# Altium schematic sheet STB_USB.SchDoc: STB Control Board - USB
size A4; Author: mayerph; DrawnBy: mayerph; Organization: PBL; Revision: B; SheetNumber: 6; SheetTotal: 6
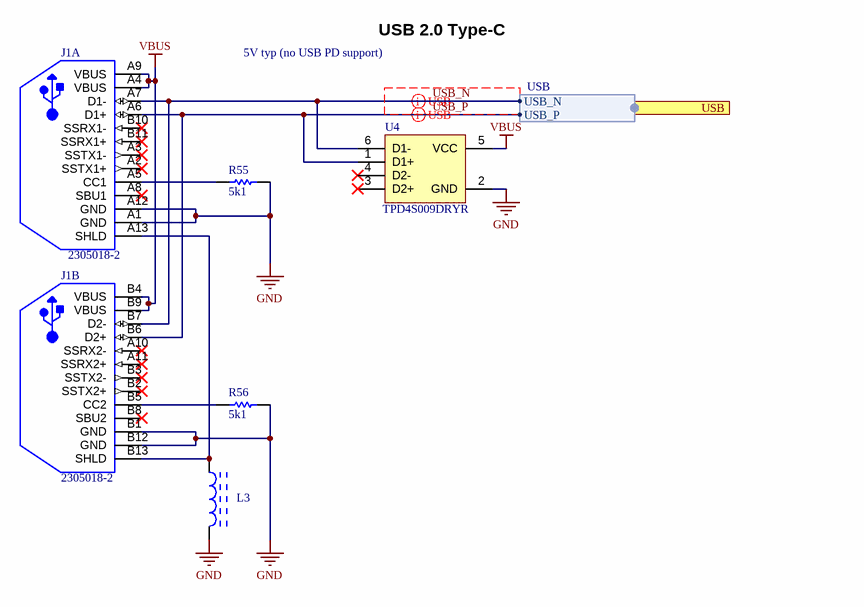
[diagram p0: STB_USB.SchDoc]

## Parts
J1  2305018-2  [2305018-2]  (parts A,B of 2)
L3  LI0402E300R-10  [INDC1005X07L]  (value not drawn)
R55  5k1  [RESC1005X40X25LL05T10]
R56  5k1  [RESC1005X40X25LL05T10]
U4  TPD4S009DRYR  [DRY0006A]

## Ports
USB (harness USB, see STB_ControlBoard[2A], STB_MCU[1A])

## Harnesses
USB: USB_N, USB_P

## Nets
GND: J1.A1(GND) J1.A12(GND) J1.B1(GND) J1.B12(GND) L3.2 R55.1 R56.1 U4.2(GND)
VBUS: J1.A4(VBUS) J1.A9(VBUS) J1.B4(VBUS) J1.B9(VBUS) U4.5(VCC)
USB_N: J1.A7(D1-) J1.B7(D2-) U4.6(D1-) ; port USB.USB_N
USB_P: J1.A6(D1+) J1.B6(D2+) U4.1(D1+) ; port USB.USB_P
NetJ1_A5: J1.A5(CC1) R55.2
NetJ1_A13: J1.A13(SHLD) J1.B13(SHLD) L3.1
NetJ1_B5: J1.B5(CC2) R56.2

Not connected (* = marked no-connect by the designer): J1 A2(SSTX1+)* A3(SSTX1-)* A8(SBU1)* A10(SSRX2-)* A11(SSRX2+)* B2(SSTX2+)* B3(SSTX2-)* B8(SBU2)* B10(SSRX1-)* B11(SSRX1+)*; U4 3(D2+)* 4(D2-)*

## Layout directives
differential pair; differential pair class USB_90R: USB_N, USB_P

## Notes on the sheet
- 5V typ (no USB PD support)
- USB 2.0 Type-C
- 1
- 2
- 3
- 4
- A
- B
- C
- Project:
- D
- Date:
- Drawing number:
- Rev:
- Format:
- A4 Q
- Drawn by:
- Laboratory:
- Page
- Sheet:
- of
- File:

## Library data of the parts
J1 = CMP-00966-1: USB TYPE C, REC IPX8 ON BOARD DUAL SMT; Manufacturer: TE Connectivity; Gender: Female; Number of Contacts: 24; Number of Ports: 1; Mounting Angle: Right Angle; IP Rating: IP67; Standard: USB; Termination Style: SMD/SMT; Mounting Style: Panel; Contact Plating: Gold; Type: C; Contact Material: Copper Alloy; Flammability Rating: UL 94 V-0; Shell Plating: Nickel; Manufacturer Part Number: 2305018-2; PartId: 1
L3 = CMP-00193-1: 30 Ohm 1 Power, Signal Line Ferrite Bead 0402 (1005 Metric) 500mA 300 mOhm Max DCR; Manufacturer: Laird-Signal Integrity Products; Number of Lines: 1; Impedance @ Frequency: 30 Ohm @ 100MHz; Packaging: Cut Tape (CT); Part Status: Active; Filter Type: Power, Signal Line; Current Rating (Max): 500mA; DC Resistance (DCR) (Max): 300 mOhm; Ratings: -; Operating Temperature: -40°C ~ 125°C; Package / Case: 0402 (1005 Metric); Mounting Type: Surface Mount; Manufacturer Part Number: LI0402E300R-10; Supplier: Digi-Key; Supplier Part Number: 240-2362-1-ND; ComponentLink1Description: Catalog_EMI%20Filtering%20&%20RF%20Inductors.pdf; ComponentLink1URL: http://cdn.lairdtech.com/home/brandworld/files/Catalog_EMI%20Filtering%20&%20RF%20Inductors.pdf
R55 R56 = CMP-2002-07753-1: Part Number: RC0402FR-075K1L; Manufacturer: Yageo / Phycomp; Tolerance: 1%; Rated Power Dissipation (P): 62.5mW; Value: 5.1 kOhm; Temperature Coefficient: 100ppm/°C; Working Voltage: 50V; Rated Temperature: 70°C; Additional Feature: LASER TRIMMABLE; Package Height: 0.35mm; Package Length: 1mm; Package Width: 0.5mm; Supplier 1: Digi-Key; Supplier Part Number 1: 311-5.10KLRDKR-ND; Manufacturer Part Number: RC0402FR-075K1L; RoHS: Yes; Category: Chip SMD Resistors; Stock 1: 2765402; Pricing 1: 1=0.10000, 10=0.01500, 100=0.00600, 1000=0.00267, 2500=0.00232, 5000=0.00192 (USD); Mount: Surface Mount; Number of Pins: 2; Package Shape: Rectangular; Size Code: 0402; Terminal Finish: Nickel; Min Operating Temperature: -55°C; Max Operating Temperature: 155°C; Resistor Type: FIXED RESISTOR; Technology: METAL GLAZE/THICK FILM; Termination: Wraparound; Packaging: Tape and Reel; Construction: Chip; Package Style: SMTMeter; JESD-609 Code: e3; REACH SVHC: Yes; RoHS Compliant: Yes; ComponentLink1URL: https://datasheet.ciiva.com:443/pdfs/VipMasterIC/IC/YAGO/YAGO-S-A0008145938/YAGO-S-A0008145938-1.pdf?src-supplier=IHS+Markit; ComponentLink1Description: https://datasheet.ciiva.com:443/pdfs/VipMasterIC/IC/YAGO/YAGO-S-A0008145938/YAGO-S-A0008145938-1.pdf?src-supplier=IHS+Markit; ComponentLink2URL: https://datasheet.ciiva.com/7983/1018594-7983519.pdf?src-supplier=Element14; ComponentLink2Description: https://datasheet.ciiva.com/7983/1018594-7983519.pdf?src-supplier=Element14; ComponentLink3URL: https://datasheet.ciiva.com/46394/1018594-46394936.pdf?src-supplier=Element14; ComponentLink3Description: https://datasheet.ciiva.com/46394/1018594-46394936.pdf?src-supplier=Element14; ComponentLink4URL: https://datasheet.ciiva.com/2453/pyu-r-int-thick-7-2453401.pdf?src-supplier=Digi-Key; ComponentLink4Description: https://datasheet.ciiva.com/2453/pyu-r-int-thick-7-2453401.pdf?src-supplier=Digi-Key; ComponentLink5URL: https://datasheet.ciiva.com/2453/pyu-r-int-thick-7-2453402.pdf?src-supplier=Digi-Key; ComponentLink5Description: https://datasheet.ciiva.com/2453/pyu-r-int-thick-7-2453402.pdf?src-supplier=Digi-Key; ComponentLink6URL: https://datasheet.ciiva.com/2453/pyu-r-int-thick-7-2453400.pdf?src-supplier=Digi-Key; ComponentLink6Description: https://datasheet.ciiva.com/2453/pyu-r-int-thick-7-2453400.pdf?src-supplier=Digi-Key; ComponentLink7URL: https://datasheet.ciiva.com/12558/pyu-rc0402-51-rohs-l-6-r-8721-12558460.pdf?src-supplier=Mouser; ComponentLink7Description: https://datasheet.ciiva.com/12558/pyu-rc0402-51-rohs-l-6-r-8721-12558460.pdf?src-supplier=Mouser; ComponentLink8URL: https://datasheet.ciiva.com/16744/pyu-rc0402-51-rohs-l-6-r-16744283.pdf?src-supplier=Future+Electronics; ComponentLink8Description: https://datasheet.ciiva.com/16744/pyu-rc0402-51-rohs-l-6-r-16744283.pdf?src-supplier=Future+Electronics; ComponentLink9URL: https://datasheet.ciiva.com/15189/getdatasheetpartid-323636-15189493.pdf?src-supplier=Verical; ComponentLink9Description: https://datasheet.ciiva.com/15189/getdatasheetpartid-323636-15189493.pdf?src-supplier=Verical
U4 = CMP-0326-00033-3: ESD Solution for High-Speed Differential Interface, 4 Channels, -40 to +85 degC, 6-pin SON (DRY), Green (RoHS & no Sb/Br); Manufacturer: Texas Instruments; Breakdown Voltage(Min)(V): 9; Differential Capacitance(pF): 0.05; IO Leakage Current(nA): Jan-00; IEC 61000-4-2 Contact(+/- kV): 8; IO Capacitance(Typ)(pF): 0.8; Direction: Unidirectional; Capacitance: 0.8pF; Number of Bidirectional Channels: 4; Reverse Standoff Voltage: 5.5V; Min Breakdown Voltage: 9V; Peak Pulse Power: 25W; Power Line Protection: Yes; Interface: LVDS,USB,Ethernet,HDMI,PCIe,SATA; Mounting Technology: Surface Mount; ComponentLink3URL: SamplesURL:http://www.ti.com/product/tpd4s009#samples; ComponentLink2URL: http://www.ti.com/general/docs/lit/getliterature.tsp?genericPartNumber=TPD4S009&fileType=pdf; ComponentLink1Description: Manufacturer URL; PackageDescription: 6-Pin Plastic Small Outline No-Lead, 1 x 1.45 x 0.6 mm Body, 0.5 mm Pitch; IEC 61000-4-2 Air-Gap(+/- kV): 9; Eco-Plan: Green (RoHS & no Sb/Br); PartNumber: TPD4S009DRYR; PackageReference: DRY0006A; DatasheetVersion: SLVS817E; ComponentLink3Description: URL Link1; SubFamily: ESD Solution; ComponentLink1URL: http://www.ti.com/; PackageVersion: revF, Dec-2011; ComponentLink2Description: Datasheet; Supplier 1: Digi-Key; Supplier Part Number 1: 296-23628-1-ND; Manufacturer Part Number: TPD4S009DRYR; RoHS: Yes; Category: Integrated Circuits (ICs); Stock 1: 8281; Pricing 1: 1=0.98000, 10=0.86400, 100=0.66240, 500=0.52364, 1000=0.41891, 2000=0.41249 (USD); Case/Package: SON; Number of Pins: 6; Contact Plating: Gold; Min Operating Temperature: -40°C; Max Operating Temperature: 85°C; Packaging: Tape and Reel; Package Quantity: 1; Breakdown Voltage: 9V; Working Voltage: 5.5V; Number of Unidirectional Channels: 4; Series: -; Length: 1.5mm; Depth: 1mm; Radiation Hardening: No; Lead Free: Lead Free; RoHS Compliant: Yes; ComponentLink4URL: https://datasheet.ciiva.com/15103/getdatasheetpartid-48198-15103810.pdf?src-supplier=Verical; ComponentLink4Description: https://datasheet.ciiva.com/15103/getdatasheetpartid-48198-15103810.pdf?src-supplier=Verical; ComponentLink5URL: https://datasheet.ciiva.com/339/tpd4s009-339414.pdf?src-supplier=Digi-Key; ComponentLink5Description: https://datasheet.ciiva.com/339/tpd4s009-339414.pdf?src-supplier=Digi-Key; ComponentLink6URL: https://datasheet.ciiva.com/339/tpd4s009-339415.pdf?src-supplier=Digi-Key; ComponentLink6Description: https://datasheet.ciiva.com/339/tpd4s009-339415.pdf?src-supplier=Digi-Key; ComponentLink7URL: https://datasheet.ciiva.com/339/tpd4s009-339416.pdf?src-supplier=Digi-Key; ComponentLink7Description: https://datasheet.ciiva.com/339/tpd4s009-339416.pdf?src-supplier=Digi-Key